# EAGLE design 36soj_bob (EAGLE 7.4.0)
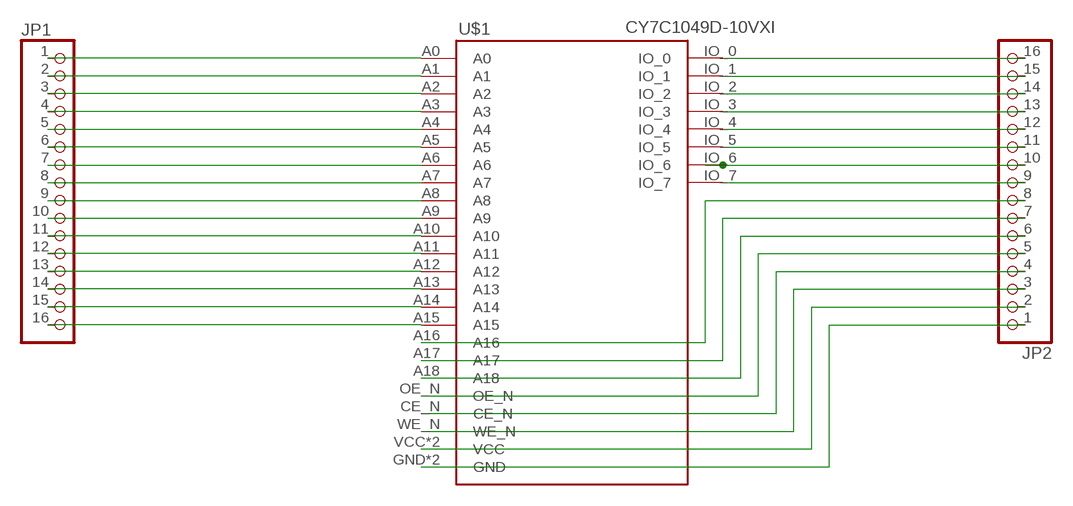
[diagram p0: schematic, sheet 1]

## Parts
JP1  PINHD-1X16  [1X16]
JP2  PINHD-1X16  [1X16]
U$1  CY7C1049D-10VXI  [SOJ36]

## Nets
N$1: JP2.16 U$1.IO_0
N$2: JP2.15 U$1.IO_1
N$3: JP2.14 U$1.IO_2
N$4: JP2.13 U$1.IO_3
N$5: JP2.12 U$1.IO_4
N$6: JP2.11 U$1.IO_5
N$7: JP2.10 U$1.IO_6
N$8: JP2.9 U$1.IO_7
N$9: JP1.1 U$1.A0
N$10: JP1.2 U$1.A1
N$11: JP1.3 U$1.A2
N$12: JP1.4 U$1.A3
N$13: JP1.5 U$1.A4
N$14: JP1.6 U$1.A5
N$15: JP1.7 U$1.A6
N$16: JP1.8 U$1.A7
N$17: JP1.9 U$1.A8
N$18: JP1.10 U$1.A9
N$19: JP1.11 U$1.A10
N$20: JP1.12 U$1.A11
N$21: JP1.13 U$1.A12
N$22: JP1.14 U$1.A13
N$23: JP1.15 U$1.A14
N$24: JP1.16 U$1.A15
N$25: JP2.8 U$1.A16
N$26: JP2.7 U$1.A17
N$27: JP2.6 U$1.A18
N$28: JP2.5 U$1.OE_N
N$29: JP2.4 U$1.CE_N
N$30: JP2.3 U$1.WE_N
N$31: JP2.2 U$1.VCC U$1.VCC_(VCC)
N$32: JP2.1 U$1.GND U$1.GND_(GND)

## Library data of the parts
JP1 JP2 = pinhead:PINHD-1X16: PIN HEADER
U$1 = CY8C5888LTI-LP097:CY7C1049D-10VXI

## Board
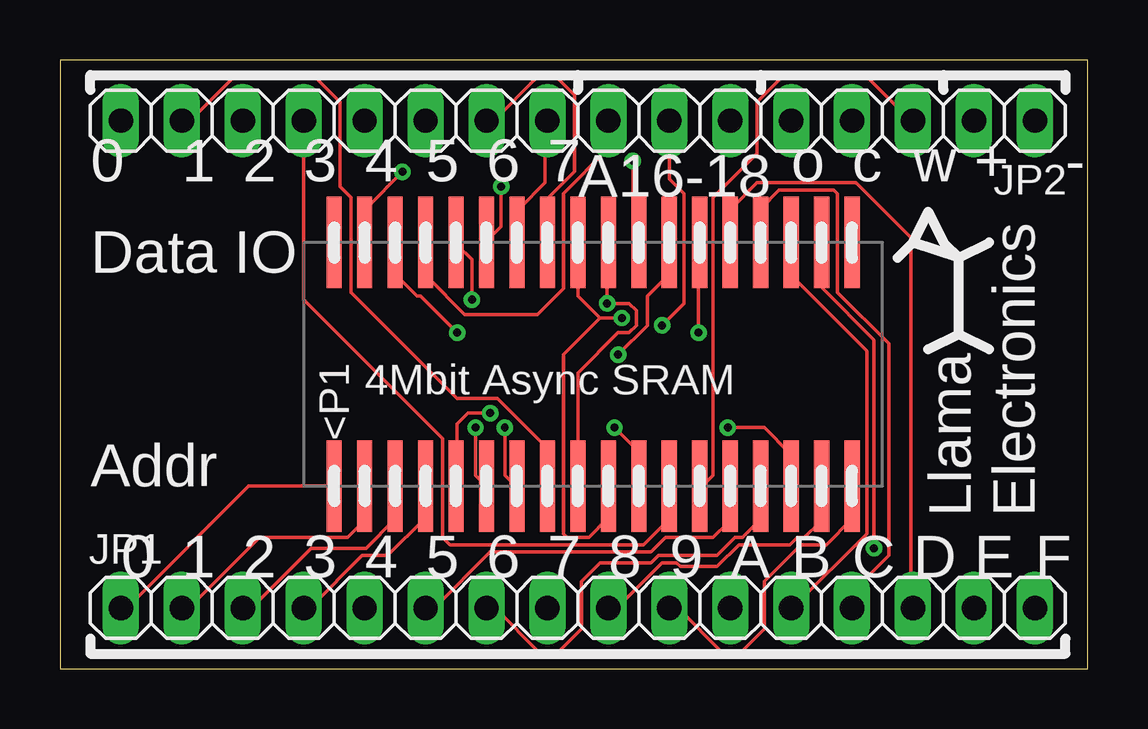
[diagram p1: board, top side]
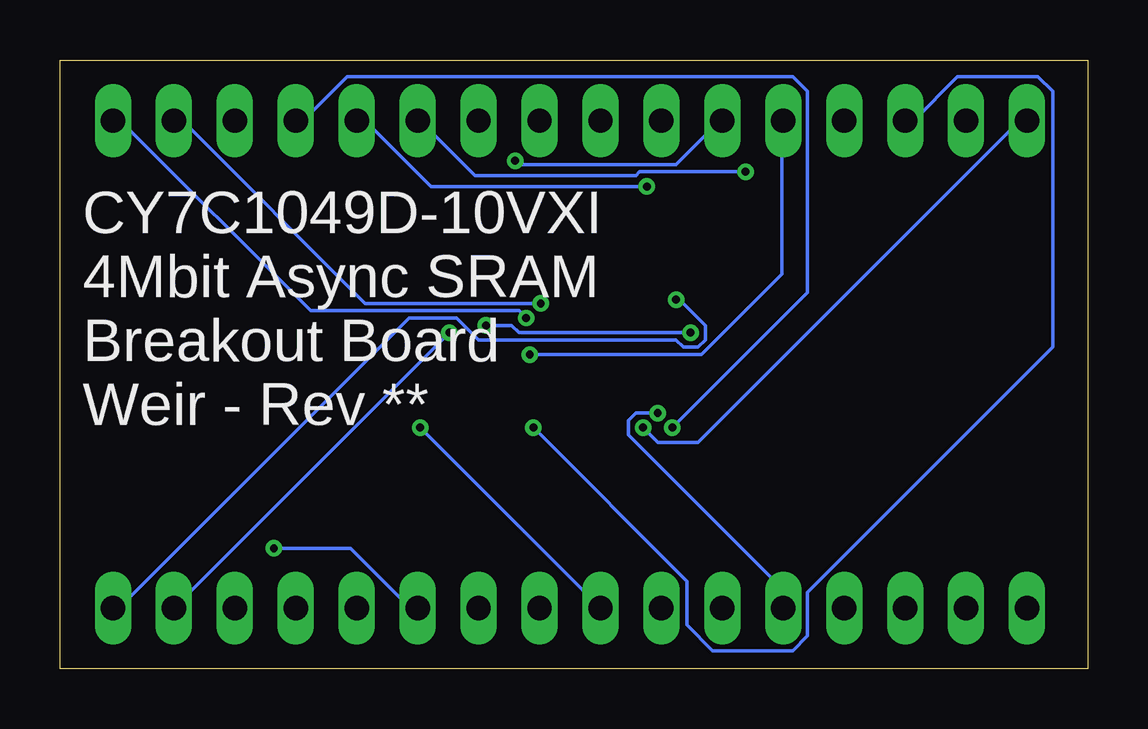
[diagram p2: board, bottom side, seen from below]

Size 42.85 x 25.39 mm. Coordinates in mm from the lower left corner, seen from the top.
Outline: 0,0 42.85,0 42.85,25.39 0,25.39 0,0
Copper layers (1*16): Top 0.0356mm / dielectric 1.5011mm / Bottom 0.0356mm
Design rules "LaenPCBOrder": minimum track width 6mil, minimum drill 13mil, track to track 6mil, track to pad 6mil, pad to pad 6mil, via to via 6mil, smd to smd 6mil, copper to edge 15mil, drill to drill 6mil, minimum pad ring 7mil, minimum via ring 7mil, stop-mask expansion 3mil, vias tented up to drill 0mil, thermal gap 10mil

### Footprints (pad centres in the part's own frame; a part is rotated, then mirrored left to right if it is on the bottom)
1X16 = drill 1.016 long: 1 -19.05,0; 2 -16.51,0; 3 -13.97,0; 4 -11.43,0; 5 -8.89,0; 6 -6.35,0; 7 -3.81,0; 8 -1.27,0; 9 1.27,0; 10 3.81,0; 11 6.35,0; 12 8.89,0; 13 11.43,0; 14 13.97,0; 15 16.51,0; 16 19.05,0
SOJ36 = smd 3.81 x 0.635: A0 1.27,22.86; A1 1.27,21.59; A2 1.27,20.32; A3 1.27,19.05; A4 1.27,17.78; A5 1.27,6.35; A6 1.27,5.08; A7 1.27,3.81; A8 1.27,2.54; A9 1.27,1.27; A10 11.43,2.54; A11 11.43,3.81; A12 11.43,5.08; A13 11.43,6.35; A14 11.43,7.62; A15 11.43,17.78; A16 11.43,19.05; A17 11.43,20.32; A18 11.43,21.59; CE_N 1.27,16.51; GND 1.27,11.43; GND_ 11.43,12.7; IO_0 1.27,15.24; IO_1 1.27,13.97; IO_2 1.27,10.16; IO_3 1.27,8.89; IO_4 11.43,8.89; IO_5 11.43,10.16; IO_6 11.43,13.97; IO_7 11.43,15.24; NC 11.43,22.86; NC_ 11.43,1.27; OE_N 11.43,16.51; VCC 1.27,12.7; VCC_ 11.43,11.43; WE_N 1.27,7.62

### Placement (x,y rotation side)
JP1  21.59,2.54 0 top
JP2  21.59,22.86 180 top
U$1  34.29,6.35 90 top

### Tracks (layer width: path | path; a pad name or v marks a point on that pad's centre or on a via)
N$1  (via drill 0.33)
  Top 0.152: v18.54,10.06 18.54,8.08 19,7.62 U$1.IO_0
  Bottom 0.152: JP2.16 2.85,22.86 16.26,9.45 17.93,9.45 v18.54,10.06
N$2
  Top 0.152: JP2.15 5.44,22.86 7.26,24.69 10.62,24.69 11.68,23.62 11.68,20.12 12.14,19.66 12.14,15.7 16.56,11.28 18.24,11.28 20.22,9.3 20.22,7.62 U$1.IO_1
N$3  (via drill 0.33)
  Top 0.152: v23.11,10.06 24.03,9.14 24.03,7.62 U$1.IO_2
  Bottom 0.152: JP2.14 7.26,22.86 5.44,24.69 2.08,24.69 1.47,24.08 1.47,13.41 11.68,3.2 11.68,1.37 12.29,0.76 15.65,0.76 16.71,1.83 16.71,3.66 v23.11,10.06
N$4
  Top 0.152: JP2.13 10.16,15.39 15.95,9.6 15.95,5.49 16.26,5.18 24.33,5.18 25.4,6.25 U$1.IO_3
N$5  (via drill 0.33)
  Top 0.152: v23.27,13.11 24.49,14.33 24.49,15.54 25.4,16.46 U$1.IO_4
  Bottom 0.152: v23.27,13.11 16.1,13.11 12.75,16.46 12.75,22.86 JP2.12
N$6  (via drill 0.33)
  Top 0.152: v23.88,21.18 23.88,17.98 24.03,17.83 U$1.IO_5
  Bottom 0.152: v23.88,21.18 23.72,21.03 17.17,21.03 15.34,22.86 JP2.11
N$7
  Top 0.152: JP2.10 18.09,22.86 19.91,24.69 20.68,24.69 21.44,23.93 21.44,20.73 20.37,19.66 20.37,17.83 U$1.IO_6
N$8
  Top 0.152: JP2.9 20.22,22.86 20.22,20.27 19.15,19.2 19.15,17.83 U$1.IO_7
N$9
  Top 0.152: U$1.A0 7.87,7.62 2.85,2.59 2.54,2.59 JP1.1
N$10
  Top 0.152: JP1.2 5.13,2.59 5.44,2.59 8.33,5.49 11.99,5.49 12.6,6.1 12.6,7.62 U$1.A1
N$11
  Top 0.152: U$1.A2 13.97,6.25 12.75,5.03 10.46,5.03 8.03,2.59 7.72,2.59 JP1.3
N$12
  Top 0.152: JP1.4 10.16,2.59 10.46,2.59 12.6,4.72 13.67,4.72 15.19,6.25 15.19,7.62 U$1.A3
N$13  (via drill 0.33)
  Top 0.152: v17.93,10.67 17.02,10.67 16.56,10.21 16.56,7.62 U$1.A4
  Bottom 0.152: v17.93,10.67 18.85,10.67 19.15,10.36 19.15,9.75 12.75,3.35 12.75,2.59 JP1.5
N$14
  Top 0.152: JP1.6 15.34,2.59 15.65,2.59 17.93,4.88 24.64,4.88 25.25,5.49 27.23,5.49 27.84,6.1 27.84,7.62 U$1.A5
N$15
  Top 0.152: U$1.A6 29.21,6.25 28.45,5.49 28.14,5.49 27.38,4.72 24.94,4.72 24.64,4.42 22.5,4.42 21.74,3.66 21.74,1.68 20.83,0.76 19.91,0.76 18.24,2.44 17.78,2.44 JP1.7
N$16  (via drill 0.33)
  Top 0.152: v27.84,10.06 29.36,10.06 30.43,8.99 30.43,7.62 U$1.A7
  Bottom 0.152: v27.84,10.06 JP1.8
N$17
  Top 0.152: JP1.9 22.96,2.59 23.27,2.59 25.09,4.42 25.71,4.42 25.86,4.27 27.38,4.27 28.3,5.18 30.43,5.18 30.73,5.49 31.04,5.49 31.65,6.1 31.65,7.62 U$1.A8
N$18
  Top 0.152: U$1.A9 33.02,6.25 31.95,5.18 30.89,5.18 29.36,3.66 29.36,1.68 28.45,0.76 27.53,0.76 25.86,2.44 25.4,2.44 JP1.10
N$19  (via drill 0.33)
  Top 0.152: v33.93,5.03 33.93,13.72 31.8,15.85 31.8,17.68 U$1.A10
  Bottom 0.152: v33.93,5.03 30.73,5.03 28.3,2.59 27.99,2.59 JP1.11
N$20
  Top 0.152: JP1.12 30.58,2.59 33.63,5.64 33.63,13.26 30.58,16.31 30.58,17.68 U$1.A11
N$21
  Top 0.152: JP1.13 33.02,3.2 34.54,4.72 34.54,13.56 32.41,15.7 32.41,19.81 32.26,19.96 29.97,19.96 29.21,19.2 U$1.A12
N$22
  Top 0.152: JP1.14 35.46,2.59 35.46,17.98 33.17,20.27 29.06,20.27 27.99,19.2 27.99,17.83 U$1.A13
N$23  (via drill 0.33)
  Top 0.152: v26.62,14.02 26.62,17.68 U$1.A14
  Bottom 0.152: v26.62,14.02 JP1.15
N$24  (via drill 0.33)
  Top 0.152: v17.17,15.39 17.17,17.07 16.56,17.68 U$1.A15
  Bottom 0.152: v17.17,15.39 17.02,15.39 15.95,14.33 15.95,13.72 16.26,13.41 16.87,13.41 17.17,13.72 25.4,13.72 26.31,14.63 28.3,14.63 40.33,2.59 40.64,2.59 JP1.16
N$25
  Top 0.152: JP2.8 22.81,22.86 22.81,21.64 20.98,19.81 20.98,15.85 19.91,14.78 16.87,14.78 15.34,16.31 15.34,17.68 U$1.A16
N$26  (via drill 0.33)
  Top 0.152: JP2.7 25.4,20.42 26.01,19.81 26.01,15.24 v25.09,14.33 | v16.56,14.02 15.04,15.54 14.88,15.54 13.97,16.46 U$1.A17
  Bottom 0.152: v25.09,14.33 24.03,14.33 23.72,14.02 v16.56,14.02
N$27  (via drill 0.33)
  Top 0.152: v14.28,20.73 12.75,19.2 12.75,17.83 U$1.A18
  Bottom 0.152: v14.28,20.73 18.69,20.73 18.85,20.57 25.55,20.57 27.84,22.86 JP2.6
N$28  (via drill 0.33)
  Top 0.152: v18.39,20.12 18.39,18.44 17.78,17.83 U$1.OE_N
  Bottom 0.152: JP2.5 30.12,22.86 27.38,20.12 v18.39,20.12
N$29  (via drill 0.33)
  Top 0.152: v17.32,10.06 17.32,8.08 U$1.CE_N
  Bottom 0.152: JP2.4 32.71,22.86 30.89,24.69 12.29,24.69 11.68,24.08 11.68,15.7 v17.32,10.06
N$30
  Top 0.152: JP2.3 35.46,22.86 33.63,24.69 30.12,24.69 29.06,23.62 29.06,21.49 27.23,19.66 27.23,8.08 26.77,7.62 U$1.WE_N
N$31  (via drill 0.33)
  Top 0.152: U$1.VCC_ 22.81,17.68 v22.81,15.24 23.72,15.24 24.03,14.94 24.03,14.33 23.72,14.02 23.27,14.02 21.59,12.34 U$1.VCC
  Bottom 0.152: JP2.2 37.74,22.86 30.12,15.24 v22.81,15.24
N$32  (via drill 0.33)
  Top 0.152: 22.5,14.63 v23.42,14.63 | 22.5,14.63 21.59,15.54 U$1.GND_ | 22.5,14.63 20.98,13.11 20.98,5.64 21.13,5.49 22.05,5.49 22.81,6.25 22.81,7.62 U$1.GND
  Bottom 0.152: JP2.1 40.33,22.86 32.41,14.94 23.72,14.94 v23.42,14.63

### Text on the board
bPlace: CY7C1049D-10VXI / 4Mbit Async SRAM / Breakout Board / Weir - Rev **
tNames: 0 | 1 | 2 | 3 | 4 | 5 | 6 | 7 | A16-18 | o | c | w | + | - | Data IO | Addr | Llama / Electronics | 0 | 1 | 2 | 3 | 4 | 5 | 6 | 7 | 8 | 9 | A | B | C | D | E | F